# Altium schematic sheet 02-TxCoil.SchDoc: WPT coil and thermistor
size A4; DocumentNumber: 2; SheetNumber: 2; SheetTotal: 12
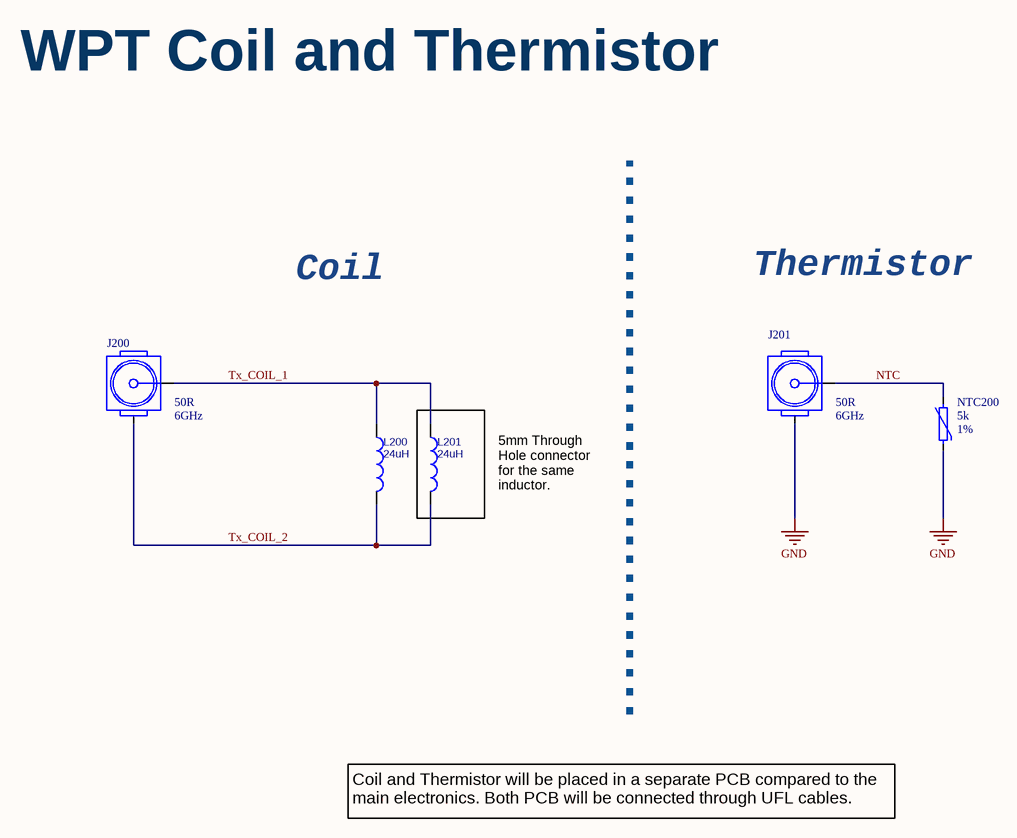
[diagram p0: 02-TxCoil.SchDoc]

## Parts
J200  Characteristic Impedance: 50R  Operating Frequency-Max: 6GHz  [FP-U_FL-R-SMT-1_10-MFG]  (hidden comment: U.FL-R-SMT-1(10))
J201  Characteristic Impedance: 50R  Operating Frequency-Max: 6GHz  [FP-U_FL-R-SMT-1_10-MFG]  (hidden comment: U.FL-R-SMT-1(10))
L200  value 24uH  [760308100110 SMD]  (hidden comment: 760308100110)
L201  value 24uH  [Coil_pads-5mm-ThroughHole]  (hidden comment: 760308100110)
NTC200  value 5k  Tolerance: 1%  [NTC0603]  (hidden comment: NTCS0603E3502FLT)

## Nets
GND: J201.2 NTC200.1
NTC: J201.1 NTC200.2
Tx_COIL_1: J200.1 L200.2 L201.2
Tx_COIL_2: J200.2 L200.1 L201.1

## Notes on the sheet
- WPT Coil and Thermistor
- Coil
- Thermistor
- 5mm Through Hole connector for the same inductor.
- Coil and Thermistor will be placed in a separate PCB compared to the main electronics. Both PCB will be connected through UFL cables.
- Project:
- Schematic:
- Ver:
- .
- Design by:
- Reviewed by:
- Date:
- Comments:

## Library data of the parts
J200 J201 = U.FL-R-SMT-1(10): RF Connector, 1 Contact(s), Male, Board Mount, Surface Mount Terminal, Receptacle; pin to pad: 2>2+3; Manufacturer: Hirose; Durability: 30Cycles; Insulation Resistance: 500MR; Number of Ports: 1; Option: General Purpose; Contact Resistance: 20mR; Contact Style: Coax; Coupling Type: Snap; Dielectric Withstanding Voltage (AC): 200V; Filter Feature: No; Mating Information: MULTIPLE MATING PARTS AVAILABLE; Panel Mount: No; VSWR: 1.5; Insertion Loss: 0.05dB; Body Depth: 0.098inch; Mounting Option 1: LOCKING; Body Diameter: 0.079inch; Reference Standard: UL; Reliability: COMMERCIAL; Supplier: Digi-Key; Supplier Part Number: H11891CT-ND; RoHS: Yes; Category: RF / Coaxial Connectors; Stock: 112692; Pricing: 1=1,35, 10=1,138, 25=1,092, 50=1,0686, 100=1,0221, 250=0,9292, 500=0,83628, 1000=0,74336 (USD); Mounting Technology: Board; Insulation Material: Polymer; Shell Finish: Silver; Shell Material: CuSn; Contact Material: Bronze; Contact Finish - Mating: GOLD; Contact Finish - Termination: GOLD; Insulation Color: Beige; Min Operating Temperature: -40°C; Max Operating Temperature: 90°C; Connector Type: RF CONNECTOR; Body/Shell Style: RECEPTACLE; Contact Gender: Male; Mounting Style: STRAIGHT; Termination: SMD/SMT; Number of Contacts: 1; JESD-609 Code: e4; Reach SVHC Compliant: Yes; RoHS Compliant: Yes; DIN Conformance: No; IEC Conformance: No; MIL Conformance: No; ComponentLink1URL: https://datasheet.ciiva.com:443/pdfs/VipMasterIC/IC/HIRO/HIROS10696/HIROS08829-1.pdf?src-supplier=IHS+Markit; ComponentLink1Description: https://datasheet.ciiva.com:443/pdfs/VipMasterIC/IC/HIRO/HIROS10696/HIROS08829-1.pdf?src-supplier=IHS+Markit; ComponentLink2URL: https://datasheet.ciiva.com/11762/0900766b8105243f-11762474.pdf?src-supplier=Rs; ComponentLink2Description: https://datasheet.ciiva.com/11762/0900766b8105243f-11762474.pdf?src-supplier=Rs; ComponentLink3URL: https://datasheet.ciiva.com/7651/91524-7651914.pdf?src-supplier=Element14; ComponentLink3Description: https://datasheet.ciiva.com/7651/91524-7651914.pdf?src-supplier=Element14; ComponentLink4URL: https://datasheet.ciiva.com/7651/91524-7651915.pdf?src-supplier=Element14; ComponentLink4Description: https://datasheet.ciiva.com/7651/91524-7651915.pdf?src-supplier=Element14; Manufacturer Part Number: U.FL-R-SMT-1(10); Supplier 1: Digikey; Supplier Part Number 1: H11891CT-ND; System: Connector
L200 L201 = 760308100110: 1 Coil, 2 Layer 24µH Wireless Charging Coil Transmitter 70mOhm; Manufacturer: Wurth; Rating: 6A; Category: Coil; Diameter: 50mm; Manufacturer Part Number: 760308100110; Thickness: 6mm; Supplier 1: Digikey; Supplier Part Number 1: 732-5283-ND
NTC200 = NTCS0603E3502FLT: NTC SMD 0603, 5KOHM, 1%, B25/85; Manufacturer: Vishay Dale; Max Power: 100mW; Manufacturer Part Number: NTCS0603E3502FLT; B Tolerance: 1%; Operating Temperature: 40°C ~ 125°C; Mounting Type: Surface Mount; Package: 0603